# EAGLE design POWER-BOARD (EAGLE 7.6.0)
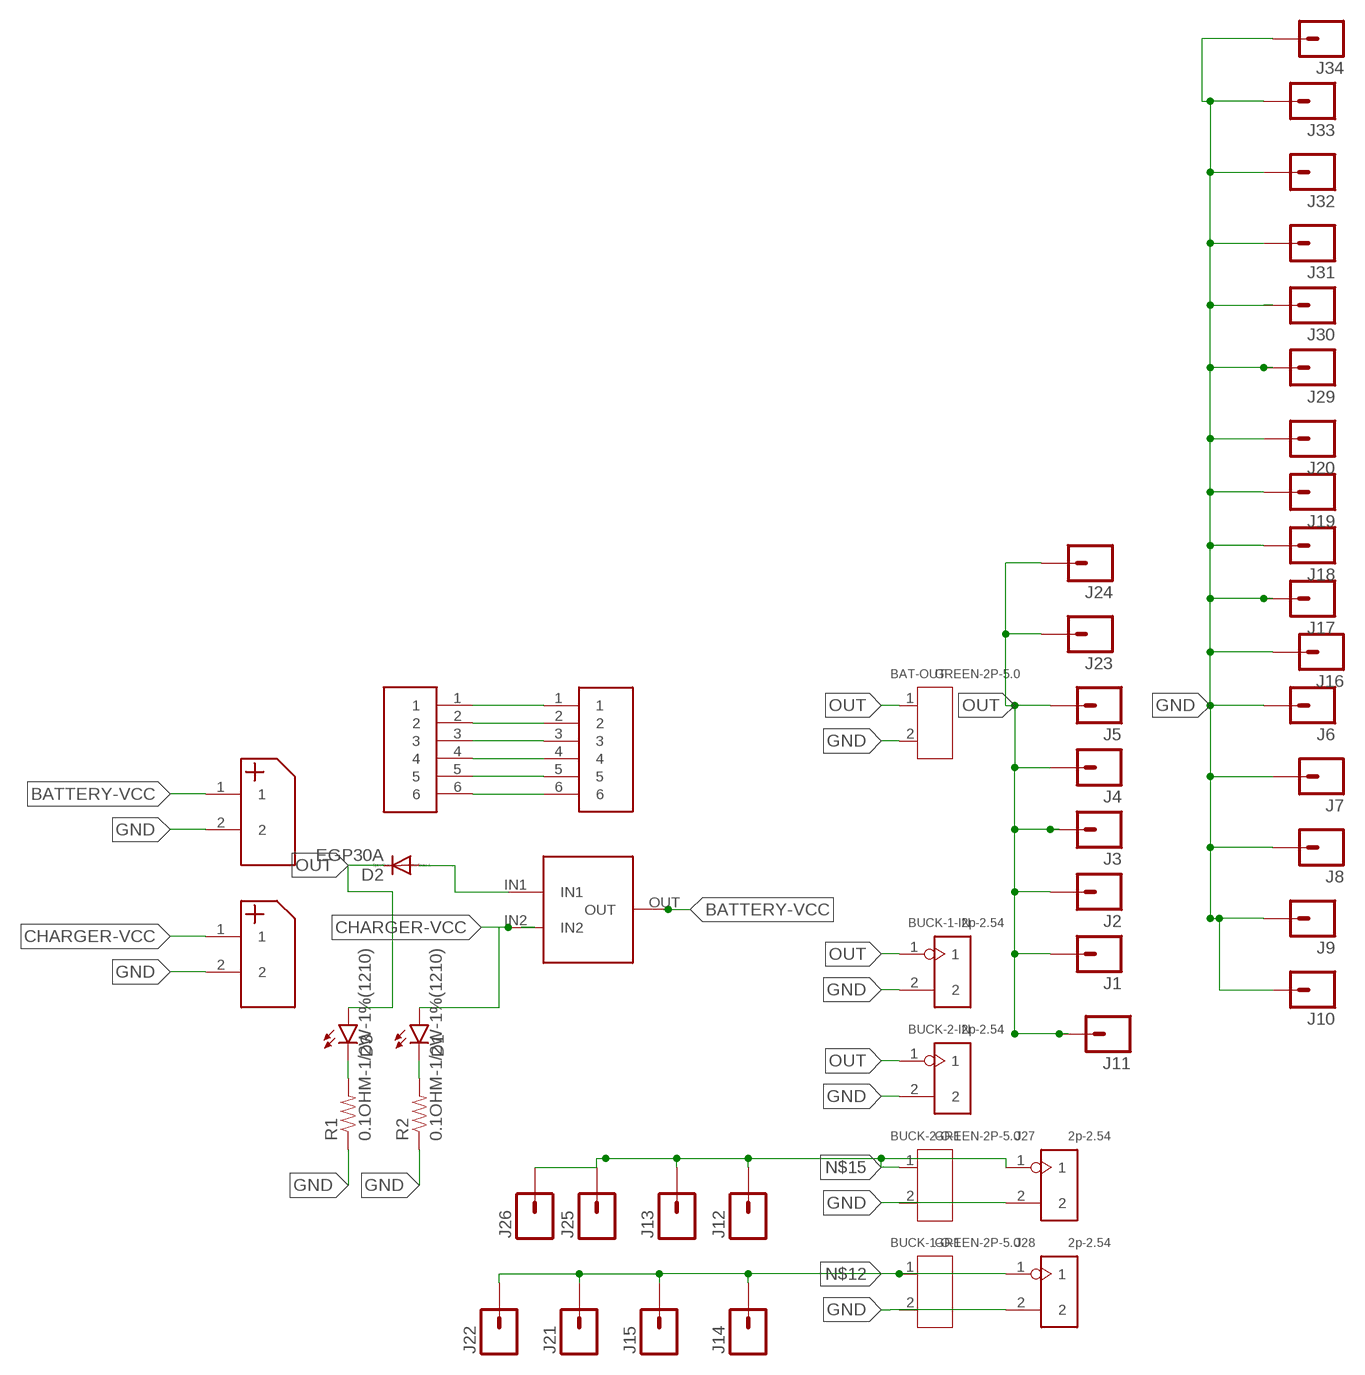
[diagram p0: schematic, sheet 1]

## Parts
BAT-OUT  GREEN-2P-5.0  SCREW-TERMINAL-GREEN(2P-5.0)  [H2-5.0-10.5X8.0MM]
BUCK-1-IN  2p-2.54  DIP-BLACK-MALE-HEADER-VERT(2P-2.54)  [H2-2.54]
BUCK-1-O-1  GREEN-2P-5.0  SCREW-TERMINAL-GREEN(2P-5.0)  [H2-5.0-10.5X8.0MM]
BUCK-2-IN  2p-2.54  DIP-BLACK-MALE-HEADER-VERT(2P-2.54)  [H2-2.54]
BUCK-2-O-1  GREEN-2P-5.0  SCREW-TERMINAL-GREEN(2P-5.0)  [H2-5.0-10.5X8.0MM]
D1  LED-FKIT-1206  [FKIT-LED-1206]
D2  EGP30A  [DO201-15]
D3  LED-FKIT-1206  [FKIT-LED-1206]
J1  M01PTH  [1X01]
J2  M01PTH  [1X01]
J3  M01PTH  [1X01]
J4  M01PTH  [1X01]
J5  M01PTH  [1X01]
J6  M01PTH  [1X01]
J7  M01PTH  [1X01]
J8  M01PTH  [1X01]
J9  M01PTH  [1X01]
J10  M01PTH  [1X01]
J11  M01PTH  [1X01]
J12  M01PTH  [1X01]
J13  M01PTH  [1X01]
J14  M01PTH  [1X01]
J15  M01PTH  [1X01]
J16  M01PTH  [1X01]
J17  M01PTH  [1X01]
J18  M01PTH  [1X01]
J19  M01PTH  [1X01]
J20  M01PTH  [1X01]
J21  M01PTH  [1X01]
J22  M01PTH  [1X01]
J23  M01PTH  [1X01]
J24  M01PTH  [1X01]
J25  M01PTH  [1X01]
J26  M01PTH  [1X01]
J27  2p-2.54  DIP-BLACK-MALE-HEADER-VERT(2P-2.54)  [H2-2.54]
J28  2p-2.54  DIP-BLACK-MALE-HEADER-VERT(2P-2.54)  [H2-2.54]
J29  M01PTH  [1X01]
J30  M01PTH  [1X01]
J31  M01PTH  [1X01]
J32  M01PTH  [1X01]
J33  M01PTH  [1X01]
J34  M01PTH  [1X01]
R1  0.1OHM-1/2W-1%(1210)  [1210]
R2  0.1OHM-1/2W-1%(1210)  [1210]
U$1  SPDT  [SWITCH]
U$2  LIPO-POWER  [LIPO-POWER]
U$3  LIPO-POWER  [LIPO-POWER]
U$4  LIPO-CHARGING  [CHARGING-CONN]
U$5  LIPO-CHARGING  [CHARGING-CONN]

## Nets
BATTERY-VCC: U$1.OUT U$2.1
CHARGER-VCC: D1.A U$1.IN2 U$3.1
GND: BAT-OUT.2 BUCK-1-IN.2 BUCK-1-O-1.2 BUCK-2-IN.2 BUCK-2-O-1.2 J6.1 J7.1 J8.1 J9.1 J10.1 J16.1 J17.1 J18.1 J19.1 J20.1 J27.2 J28.2 J29.1 J30.1 J31.1 J32.1 J33.1 J34.1 R1.1 R2.1 U$2.2 U$3.2
N$1: D2.A U$1.IN1
N$3: D3.C R1.2
N$4: D1.C R2.2
N$5: U$4.1 U$5.1
N$6: U$4.2 U$5.2
N$7: U$4.3 U$5.3
N$8: U$4.4 U$5.4
N$9: U$4.5 U$5.5
N$10: U$4.6 U$5.6
N$12: BUCK-1-O-1.1 J14.1 J15.1 J21.1 J22.1 J28.1
N$15: BUCK-2-O-1.1 J12.1 J13.1 J25.1 J26.1 J27.1
OUT: BAT-OUT.1 BUCK-1-IN.1 BUCK-2-IN.1 D2.C D3.A J1.1 J2.1 J3.1 J4.1 J5.1 J11.1 J23.1 J24.1

## Library data of the parts
BAT-OUT BUCK-1-O-1 BUCK-2-O-1 = Seeed-Connector -2016:SCREW-TERMINAL-GREEN(2P-5.0): 320110031
BUCK-1-IN BUCK-2-IN J27 J28 = Seeed-Connector -2016:DIP-BLACK-MALE-HEADER-VERT(2P-2.54): 320020016; MPN: P125-1102A0BS116A1
D1 D3 = SparkFun-LED:LED: LEDs Standard schematic elements and footprints for 5mm, 3mm, 1206, and 0603 sized LEDs. 5mm - Spark Fun Electronics SKU : COM-00529 (and others)
D2 = diode:EGP30A: DIODE ultra fast-recovery rectifier
J1-J26 J29-J34 = SparkFun-Connectors:M01: Header 1 Standard 1-pin 0.1" header. Use with straight break away headers (SKU : PRT-00116), right angle break away headers (PRT-00553), swiss pins (PRT-00743), machine pins (PRT-00117), and female headers (PRT-00115). SMTSO-256-ET is a "flush mount" nut for a 4-40 screw. The older package used to be too tight, and did not allow it to sit properly thru the drill hit. The latest (0.165DIA) fits nice and snug.
R1 R2 = SparkFun-Resistors:0.1OHM-1/2W-1%(1210); PROD_ID: RES-12374
U$1 = Musafir Power Board Library:SPDT
U$2 U$3 = Musafir Power Board Library:LIPO-POWER
U$4 U$5 = Musafir Power Board Library:LIPO-CHARGING

## Board
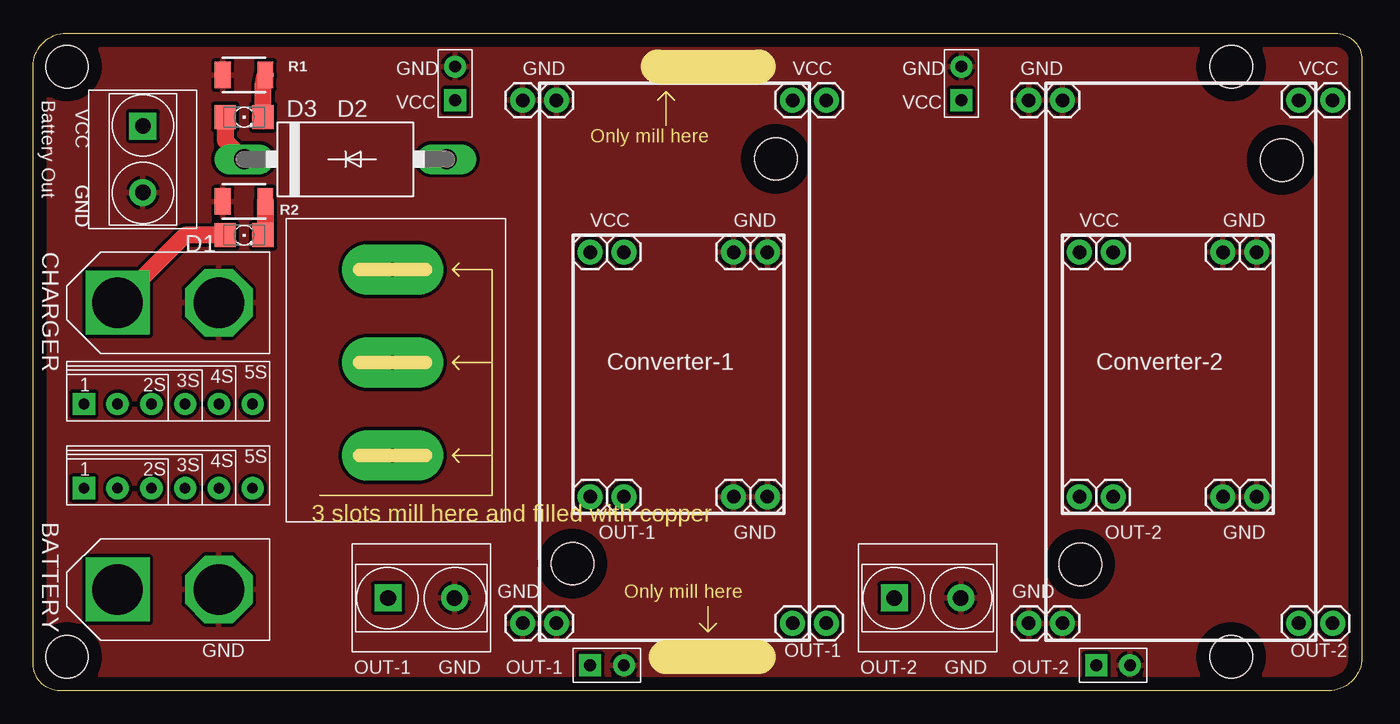
[diagram p1: board, top side]
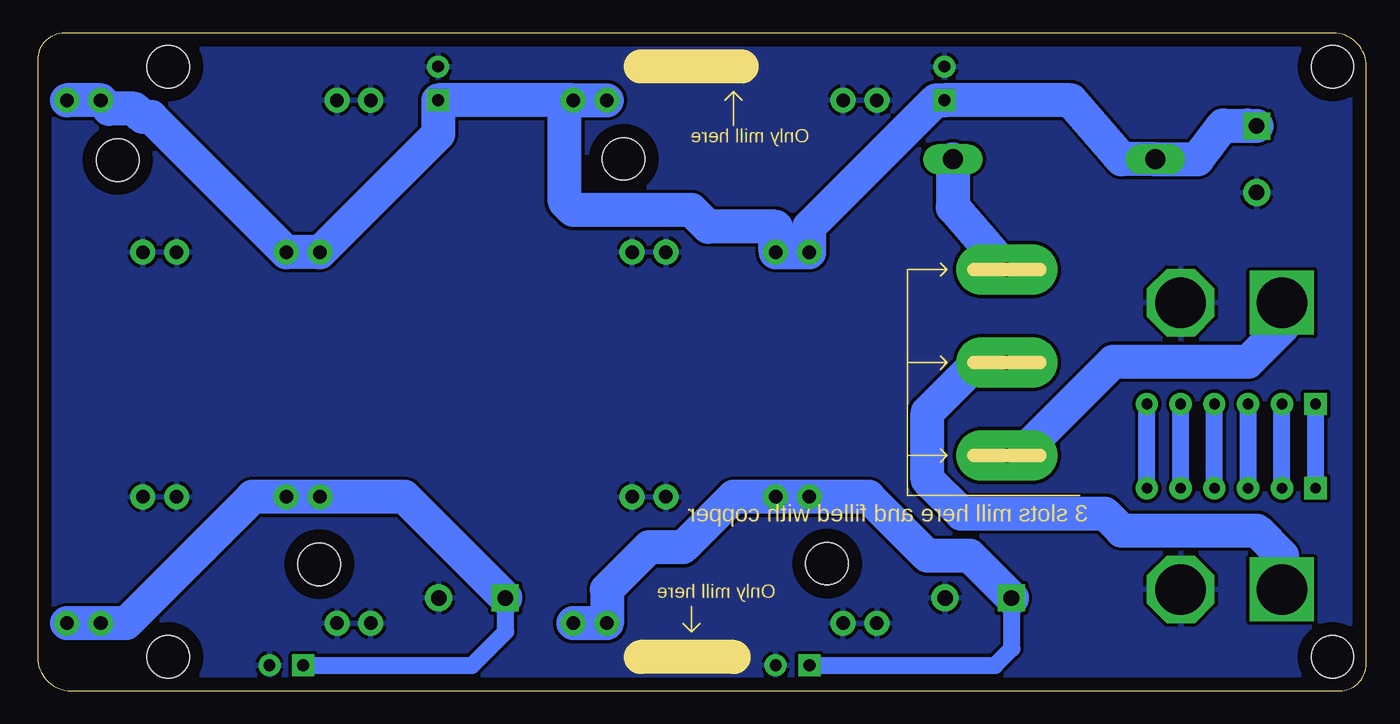
[diagram p2: board, bottom side, seen from below]

Size 100 x 49.5 mm. Coordinates in mm from the lower left corner, seen from the top.
Outline: 0,2 0,47 arc-90 2.5,49.5 98,49.5 arc-90 100,47.5 100,2.5 arc-90 97.5,0 2,0 arc-90 0,2
Copper layers (1*16): Top 0.035mm / dielectric 1.5mm / Bottom 0.035mm
Design rules "default": minimum track width 10mil, minimum drill 24mil, track to track 8mil, track to pad 8mil, pad to pad 8mil, via to via 8mil, smd to smd 8mil, copper to edge 40mil, drill to drill 8mil, minimum pad ring 10mil, minimum via ring 8mil, stop-mask expansion 4mil, vias tented up to drill 0mil, thermal gap 10mil
Holes 3.2 mm at 55.89,40.03 40.59,9.57 93.97,39.95 78.81,9.52 2.54,2.54 2.54,46.99 90.17,2.54 90.17,46.99
Milling: 8 lines

### Footprints (pad centres in the part's own frame; a part is rotated, then mirrored left to right if it is on the bottom)
H2-5.0-10.5X8.0MM = drill 1.168 pad 2.032 square: 1 0,2.5 | drill 1.168 pad 2.032: 2 0,-2.5
H2-2.54 = drill 0.889 pad 1.651 square: 1 0,1.27 | drill 0.889 pad 1.651: 2 0,-1.27
FKIT-LED-1206 = smd 1.6 x 1.803: A -1.422,0; C 1.422,0
DO201-15 = drill 1.499 long: A 7.62,0; C -7.62,0
1X01 = drill 1.016 pad 1.88: 1 0,0
1210 = smd 1.2 x 2: 1 -1.6,0; 2 1.6,0
SWITCH = drill 1.05 pad 3.81 long: IN1 8,19; IN2 8,5; OUT 8,12
LIPO-POWER = drill 3.81 square: 1 3.81,11.43 | drill 3.81 pad 5.08 octagon: 2 3.81,3.81
CHARGING-CONN = drill 0.8 pad 1.676 square: 1 0,0 | drill 0.8 pad 1.676: 2 2.54,0; 3 5.08,0; 4 7.62,0; 5 10.16,0; 6 12.7,0

### Placement (x,y rotation side)
BAT-OUT  8.26,40.01 0 top
BUCK-1-IN  31.75,45.72 180 top
BUCK-1-O-1  29.21,6.99 90 top
BUCK-2-IN  69.85,45.72 180 top
BUCK-2-O-1  67.31,6.99 90 top
D1  15.88,34.29 0 top
D2  23.5,40.01 0 top
D3  15.88,43.18 0 top
J1  97.79,44.45 0 top
J2  57.15,44.45 0 top
J3  59.69,44.45 0 top
J4  95.25,44.45 0 top
J5  44.45,33.02 0 top
J6  77.47,5.08 0 top
J7  55.24,14.61 0 top
J8  74.93,5.08 0 top
J9  39.37,5.08 0 top
J10  39.37,44.45 0 top
J11  41.91,33.02 90 top
J12  95.25,5.08 0 top
J13  97.79,5.08 0 top
J14  57.15,5.08 0 top
J15  59.69,5.08 0 top
J16  92.08,14.61 0 top
J17  89.53,14.61 0 top
J18  36.83,5.08 0 top
J19  36.83,44.45 0 top
J20  77.47,44.45 0 top
J21  41.91,14.61 90 top
J22  44.45,14.61 90 top
J23  78.74,33.02 0 top
J24  81.28,33.02 0 top
J25  78.74,14.61 90 top
J26  81.28,14.61 90 top
J27  81.28,1.91 90 top
J28  43.18,1.91 90 top
J29  74.93,44.45 0 top
J30  52.7,14.61 0 top
J31  55.24,33.02 0 top
J32  52.7,33.02 0 top
J33  92.08,33.02 0 top
J34  89.53,33.02 0 top
R1  15.88,46.35 0 top
R2  15.88,36.83 0 top
U$1  19.05,12.7 0 top
U$2  17.78,3.81 90 top
U$3  17.78,25.4 90 top
U$4  3.81,21.59 0 top
U$5  3.81,15.24 0 top

### Tracks (layer width: path | path; a pad name or v marks a point on that pad's centre or on a via)
BATTERY-VCC
  Bottom 2.54: U$2.1 6.35,10.16 8.26,12.06 18.41,12.06 19.68,13.34 30.48,13.34 33.02,15.88 33.02,20.95 29.84,24.13 27.62,24.13 U$1.OUT
CHARGER-VCC
  Top 1.27: D1.A 11.43,34.29 U$3.1
  Bottom 2.54: U$1.IN2 26.11,17.7 19.05,24.77 8.89,24.77 6.35,27.3 U$3.1
GND
  pour Top (isolate 0.254): 97.5,49.5 arc-90 100.64,47 100.64,2 arc-90 98,0 2,0 arc-90 0,2 0,47 arc-90 2.5,49.5
  pour Bottom (isolate 0.254): 3,49.5 98,49.5 arc-90 100,47.5 100,2.5 arc-90 97.5,0 2,0 arc-90 0,2 0,46.5 arc-90
N$1
  Bottom 2.54: D2.A 31.11,36.4 U$1.IN1
N$3
  Top 1.27: D3.C 17.3,45.54 R1.2
N$4
  Top 1.27: R2.2 17.48,34.47 D1.C
N$5
  Bottom 1.27: U$5.1 U$4.1
N$6
  Bottom 1.27: U$5.2 U$4.2
N$7
  Bottom 1.27: U$5.3 U$4.3
N$8
  Bottom 1.27: U$5.4 U$4.4
N$9
  Bottom 1.27: U$5.5 U$4.5
N$10
  Bottom 1.27: U$5.6 U$4.6
N$12
  Bottom 1.27: J28.1 27.94,1.91 26.67,3.17 26.67,6.95 BUCK-1-O-1.1
  Bottom 2.54: BUCK-1-O-1.1 26.67,6.99 29.84,10.16 33.02,10.16 37.47,14.61 J21.1 J22.1 47.62,14.61 51.44,10.79 53.98,10.79 57.15,7.62 J14.1 J15.1
N$15
  Bottom 1.27: J27.1 67.31,1.91 64.77,4.45 64.77,6.95 BUCK-2-O-1.1
  Bottom 2.54: BUCK-2-O-1.1 64.81,7.03 72.39,14.61 J25.1 J26.1 83.82,14.61 93.34,5.08 J12.1 J13.1
OUT
  Top 1.27: D3.A 14.45,41.43 D2.C
  Bottom 2.54: BAT-OUT.1 8.93,42.55 10.79,42.55 12.7,40.01 D2.C 18.41,40.01 22.23,44.45 BUCK-1-IN.1 32.38,44.45 41.91,34.92 J11.1 J5.1 44.45,34.92 49.53,34.92 50.8,36.2 59.69,36.2 60.33,36.83 60.33,44.45 | 60.33,44.45 J3.1 J2.1 | 60.33,44.45 BUCK-2-IN.1 69.85,41.91 J23.1 J24.1 91.44,43.18 92.08,43.18 92.71,43.81 94.61,43.81 J4.1 J1.1

### Text on the board
tNames: GND | GND | VCC | GND | GND | VCC | Battery Out | VCC | VCC | VCC | GND | GND | VCC | GND | VCC | GND | CHARGER | Converter-1 | Converter-2 | BATTERY | OUT-1 | GND | OUT-2 | GND | GND | GND | GND | OUT-1 | OUT-2 | OUT-1 | GND | OUT-1 | OUT-2 | GND | OUT-2
Milling: Only mill here | Only mill here